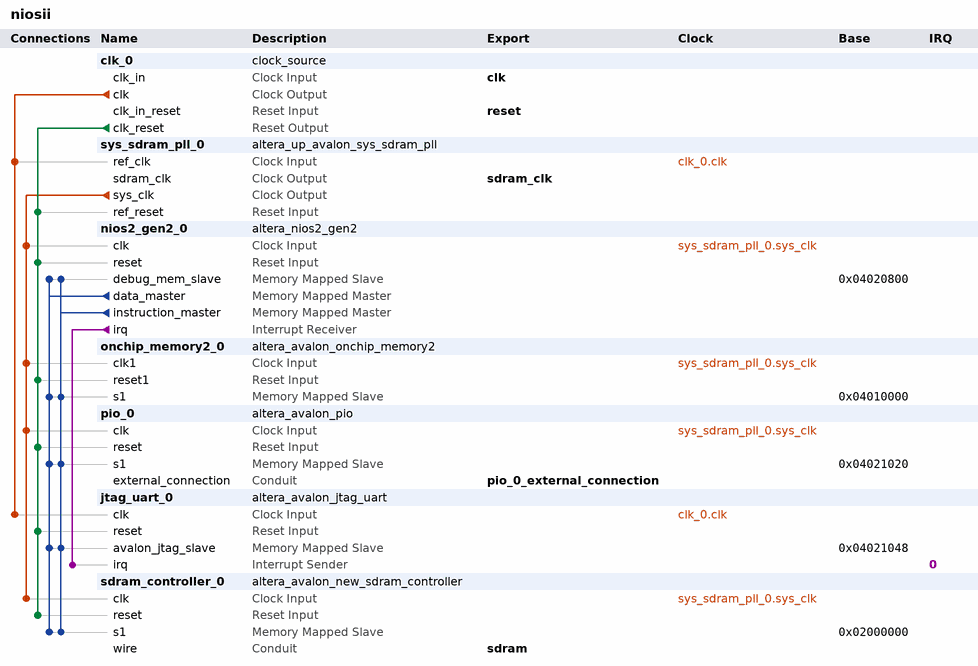
[diagram p0: system contents]
# Platform Designer (Qsys) system niosii, Cyclone IV E EP4CE22F17C6
# Parameters at their usual value, and those the tool derives, are not listed.
package require -exact qsys 15.1
create_system niosii
set_project_property DEVICE_FAMILY {Cyclone IV E}
set_project_property DEVICE EP4CE22F17C6

add_instance clk_0 clock_source 15.1
set_instance_parameter_value clk_0 clockFrequency 50000000

add_instance sys_sdram_pll_0 altera_up_avalon_sys_sdram_pll 15.1
set_instance_parameter_value sys_sdram_pll_0 CIV_boards DE0-Nano
set_instance_parameter_value sys_sdram_pll_0 CV_boards DE1-SoC
set_instance_parameter_value sys_sdram_pll_0 gui_outclk 50.0
set_instance_parameter_value sys_sdram_pll_0 gui_refclk 50.0

add_instance nios2_gen2_0 altera_nios2_gen2 15.1
set_instance_parameter_value nios2_gen2_0 dcache_size 2048
set_instance_parameter_value nios2_gen2_0 exceptionSlave sdram_controller_0.s1
set_instance_parameter_value nios2_gen2_0 icache_size 4096
set_instance_parameter_value nios2_gen2_0 impl Tiny
set_instance_parameter_value nios2_gen2_0 resetSlave sdram_controller_0.s1

add_instance onchip_memory2_0 altera_avalon_onchip_memory2 15.1
set_instance_parameter_value onchip_memory2_0 dataWidth 32
set_instance_parameter_value onchip_memory2_0 dualPort false
set_instance_parameter_value onchip_memory2_0 initMemContent true
set_instance_parameter_value onchip_memory2_0 initializationFileName onchip_mem.hex
set_instance_parameter_value onchip_memory2_0 memorySize 48000

add_instance pio_0 altera_avalon_pio 15.1
set_instance_parameter_value pio_0 direction Output
set_instance_parameter_value pio_0 width 8

add_instance jtag_uart_0 altera_avalon_jtag_uart 15.1
set_instance_parameter_value jtag_uart_0 simInteractiveOptions NO_INTERACTIVE_WINDOWS

add_instance sdram_controller_0 altera_avalon_new_sdram_controller 15.1
set_instance_parameter_value sdram_controller_0 TAC 5.5
set_instance_parameter_value sdram_controller_0 TRCD 20.0
set_instance_parameter_value sdram_controller_0 TRP 20.0
set_instance_parameter_value sdram_controller_0 casLatency 3
set_instance_parameter_value sdram_controller_0 columnWidth 9
set_instance_parameter_value sdram_controller_0 dataWidth 16
set_instance_parameter_value sdram_controller_0 generateSimulationModel false
set_instance_parameter_value sdram_controller_0 model single_Micron_MT48LC4M32B2_7_chip
set_instance_parameter_value sdram_controller_0 numberOfBanks 4
set_instance_parameter_value sdram_controller_0 numberOfChipSelects 1
set_instance_parameter_value sdram_controller_0 powerUpDelay 100.0
set_instance_parameter_value sdram_controller_0 refreshPeriod 15.625
set_instance_parameter_value sdram_controller_0 rowWidth 13

# connections
add_connection clk_0.clk jtag_uart_0.clk clock
add_connection clk_0.clk sys_sdram_pll_0.ref_clk clock
add_connection sys_sdram_pll_0.sys_clk nios2_gen2_0.clk clock
add_connection sys_sdram_pll_0.sys_clk onchip_memory2_0.clk1 clock
add_connection sys_sdram_pll_0.sys_clk pio_0.clk clock
add_connection sys_sdram_pll_0.sys_clk sdram_controller_0.clk clock
add_connection clk_0.clk_reset jtag_uart_0.reset reset
add_connection clk_0.clk_reset nios2_gen2_0.reset reset
add_connection clk_0.clk_reset onchip_memory2_0.reset1 reset
add_connection clk_0.clk_reset pio_0.reset reset
add_connection clk_0.clk_reset sdram_controller_0.reset reset
add_connection clk_0.clk_reset sys_sdram_pll_0.ref_reset reset
add_connection nios2_gen2_0.data_master jtag_uart_0.avalon_jtag_slave avalon
set_connection_parameter_value nios2_gen2_0.data_master/jtag_uart_0.avalon_jtag_slave baseAddress 0x04021048
add_connection nios2_gen2_0.data_master nios2_gen2_0.debug_mem_slave avalon
set_connection_parameter_value nios2_gen2_0.data_master/nios2_gen2_0.debug_mem_slave baseAddress 0x04020800
add_connection nios2_gen2_0.data_master onchip_memory2_0.s1 avalon
set_connection_parameter_value nios2_gen2_0.data_master/onchip_memory2_0.s1 baseAddress 0x04010000
add_connection nios2_gen2_0.data_master pio_0.s1 avalon
set_connection_parameter_value nios2_gen2_0.data_master/pio_0.s1 baseAddress 0x04021020
add_connection nios2_gen2_0.data_master sdram_controller_0.s1 avalon
set_connection_parameter_value nios2_gen2_0.data_master/sdram_controller_0.s1 baseAddress 0x02000000
add_connection nios2_gen2_0.instruction_master jtag_uart_0.avalon_jtag_slave avalon
set_connection_parameter_value nios2_gen2_0.instruction_master/jtag_uart_0.avalon_jtag_slave baseAddress 0x04021048
add_connection nios2_gen2_0.instruction_master nios2_gen2_0.debug_mem_slave avalon
set_connection_parameter_value nios2_gen2_0.instruction_master/nios2_gen2_0.debug_mem_slave baseAddress 0x04020800
add_connection nios2_gen2_0.instruction_master onchip_memory2_0.s1 avalon
set_connection_parameter_value nios2_gen2_0.instruction_master/onchip_memory2_0.s1 baseAddress 0x04010000
add_connection nios2_gen2_0.instruction_master pio_0.s1 avalon
set_connection_parameter_value nios2_gen2_0.instruction_master/pio_0.s1 baseAddress 0x04021020
add_connection nios2_gen2_0.instruction_master sdram_controller_0.s1 avalon
set_connection_parameter_value nios2_gen2_0.instruction_master/sdram_controller_0.s1 baseAddress 0x02000000
add_connection nios2_gen2_0.irq jtag_uart_0.irq interrupt
set_connection_parameter_value nios2_gen2_0.irq/jtag_uart_0.irq irqNumber 0

# exported interfaces
add_interface clk clock sink
set_interface_property clk EXPORT_OF clk_0.clk_in
add_interface pio_0_external_connection conduit end
set_interface_property pio_0_external_connection EXPORT_OF pio_0.external_connection
add_interface reset reset sink
set_interface_property reset EXPORT_OF clk_0.clk_in_reset
add_interface sdram conduit end
set_interface_property sdram EXPORT_OF sdram_controller_0.wire
add_interface sdram_clk clock source
set_interface_property sdram_clk EXPORT_OF sys_sdram_pll_0.sdram_clk

set_interconnect_requirement {$system} qsys_mm.clockCrossingAdapter HANDSHAKE
set_interconnect_requirement {$system} qsys_mm.enableEccProtection FALSE
set_interconnect_requirement {$system} qsys_mm.insertDefaultSlave FALSE
set_interconnect_requirement {$system} qsys_mm.maxAdditionalLatency 1

save_system niosii.qsys
